# Altium schematic sheet INDEX.SchDoc: INDEX
size 420 x 297 mm; CheckedBy: BAO BUI Q.; Author: SANG HUYNH; DocumentNumber: 1; Revision: V1.0.0; SheetNumber: 2; SheetTotal: 12
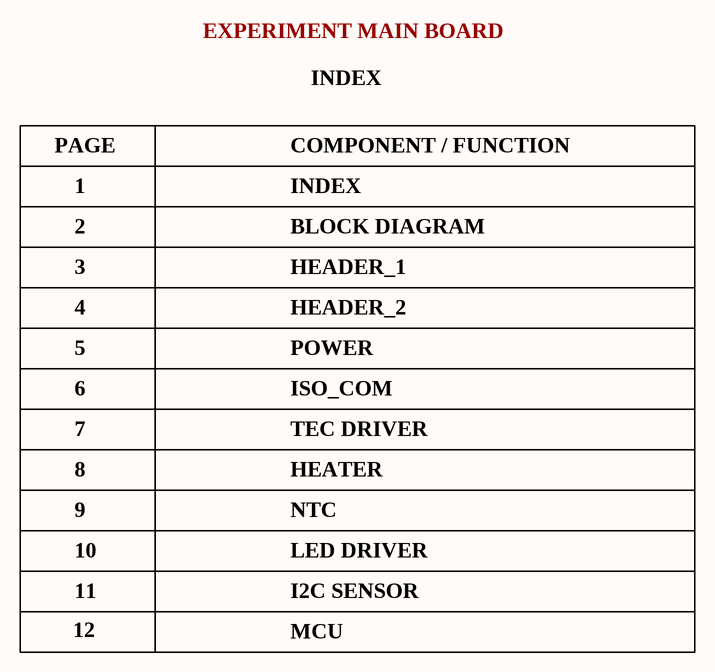
[diagram p0: INDEX.SchDoc]

## Notes on the sheet
- EXPERIMENT MAIN BOARD
- PAGE
- COMPONENT / FUNCTION
- INDEX
- 1
- 2
- 3
- BLOCK DIAGRAM
- HEADER_1
- 4
- HEADER_2
- 5
- 6
- POWER
- ISO_COM
- 7
- 8
- TEC DRIVER
- HEATER
- 9
- 10
- NTC
- LED DRIVER
- 11
- I2C SENSOR
- 12
- MCU
- Project:
- PEE-PC1
- Sub-system:
- NANORACK_EXP_CONTROLLER
- Design by:
- SANG HUYNH
- BAO BUI Q.
- Sheet title:
- Sheet
- A3
- of
- Checked by:
- Approved by:
- VU PHAM
- Revision:
- Document No:
- V1.0.0
- Size:
- Date: